# Altium schematic sheet WR_Clocking.SchDoc
size A4; DocumentNumber: 51; SheetNumber: 51; SheetTotal: 54
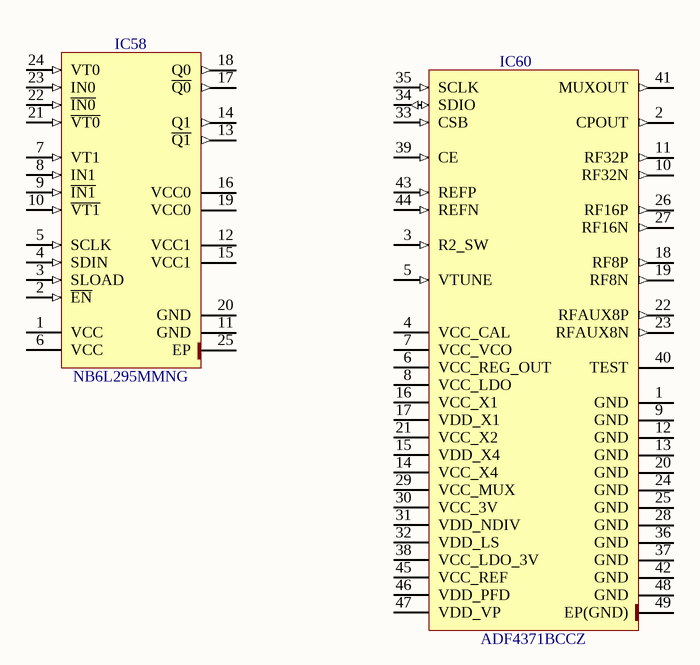
[diagram p0: WR_Clocking.SchDoc]

## Parts
IC58  NB6L295MMNG  [QFN50P400X400X100-25N-S290]
IC60  ADF4371BCCZ  [PQFN50P700X700X115-49N-S500]

## Nets

Not connected (* = marked no-connect by the designer): IC58 1(VCC) 2(~{EN}) 3(SLOAD) 4(SDIN) 5(SCLK) 6(VCC) 7(VT1) 8(IN1) 9(~{IN1}) 10(~{VT1}) 11(GND) 12(VCC1) 13(~{Q1}) 14(Q1) 15(VCC1) 16(VCC0) 17(~{Q0}) 18(Q0) 19(VCC0) 20(GND) 21(~{VT0}) 22(~{IN0}) 23(IN0) 24(VT0) 25(EP); IC60 1(GND) 2(CPOUT) 3(R2_SW) 4(VCC_CAL) 5(VTUNE) 6(VCC_REG_OUT) 7(VCC_VCO) 8(VCC_LDO) 9(GND) 10(RF32N) 11(RF32P) 12(GND) 13(GND) 14(VCC_X4) 15(VDD_X4) 16(VCC_X1) 17(VDD_X1) 18(RF8P) 19(RF8N) 20(GND) 21(VCC_X2) 22(RFAUX8P) 23(RFAUX8N) 24(GND) 25(GND) 26(RF16P) 27(RF16N) 28(GND) 29(VCC_MUX) 30(VCC_3V) 31(VDD_NDIV) 32(VDD_LS) 33(CSB) 34(SDIO) 35(SCLK) 36(GND) 37(GND) 38(VCC_LDO_3V) 39(CE) 40(TEST) 41(MUXOUT) 42(GND) 43(REFP) 44(REFN) 45(VCC_REF) 46(VDD_PFD) 47(VDD_VP) 48(GND) 49(EP(GND))

## Library data of the parts
IC58 = NB6L295MMNG: 2.5V / 3.3V Dual Channel Programmable Clock/Data Delay with Differential CML Outputs; Manufacturer: ON SEMICONDUCTOR; PressFit: No; Bonding: No; Part Number: NB6L295MMNG; Component Kind: Standard; Component Type: Standard; Device: NB6L295MMNG; PackageDescription: QFN, 0.50mm Pitch, Square; 24 Pin, 4.00mm L X 4.00mm W X 1.00mm H Body (w/Thermal Tab 2.90 X 2.90mm),  IPC Medium Density; Part Description: 2.5V / 3.3V Dual Channel Programmable Clock/Data Delay with Differential CML Outputs; Manufacturer Part Number: NB6L295MMNG; Pin Count: 25; Case: QFN24; Mounted: Yes; Socket: No; SMD: Yes; Sense: No; ComponentHeight: 1mm; Author: CERN DEM JLC; HelpURL: \\cern.ch\dfs\Applications\Altium\Datasheets\NB6L295MMNG.pdf; CreateDate: 29.11.2018; LatestRevisionDate: 29.11.2018
IC60 = ADF4371BCCZ: Microwave Wideband Synthesizer with Integrated VCO; Manufacturer: ANALOG DEVICES; PressFit: No; Bonding: No; Part Number: ADF4371BCCZ; Component Kind: Standard; Component Type: Standard; Device: ADF4371BCCZ; PackageDescription: PQFN, 0.50mm Pitch, Square; 48 Pin, 7.00mm L X 7.00mm W X 1.00mm H Body (w/Pullback Leads,Thermal Tab 5X5mm); Part Description: Microwave Wideband Synthesizer with Integrated VCO; Manufacturer Part Number: ADF4371BCCZ; Pin Count: 49; Case: LGA48; Mounted: Yes; Socket: No; SMD: Yes; Sense: No; ComponentHeight: 1.158mm; Author: CERN DEM JLC; HelpURL: \\cern.ch\dfs\Applications\Altium\Datasheets\ADF4371BCCZ.pdf; CreateDate: 06.12.2018; LatestRevisionDate: 06.12.2018